# EAGLE design PWR1 (EAGLE 4.16)
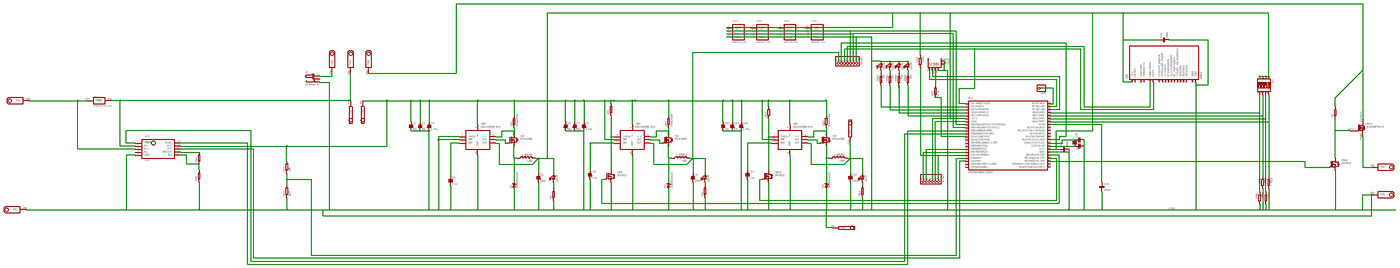
[diagram p0: schematic, sheet 1, overview]
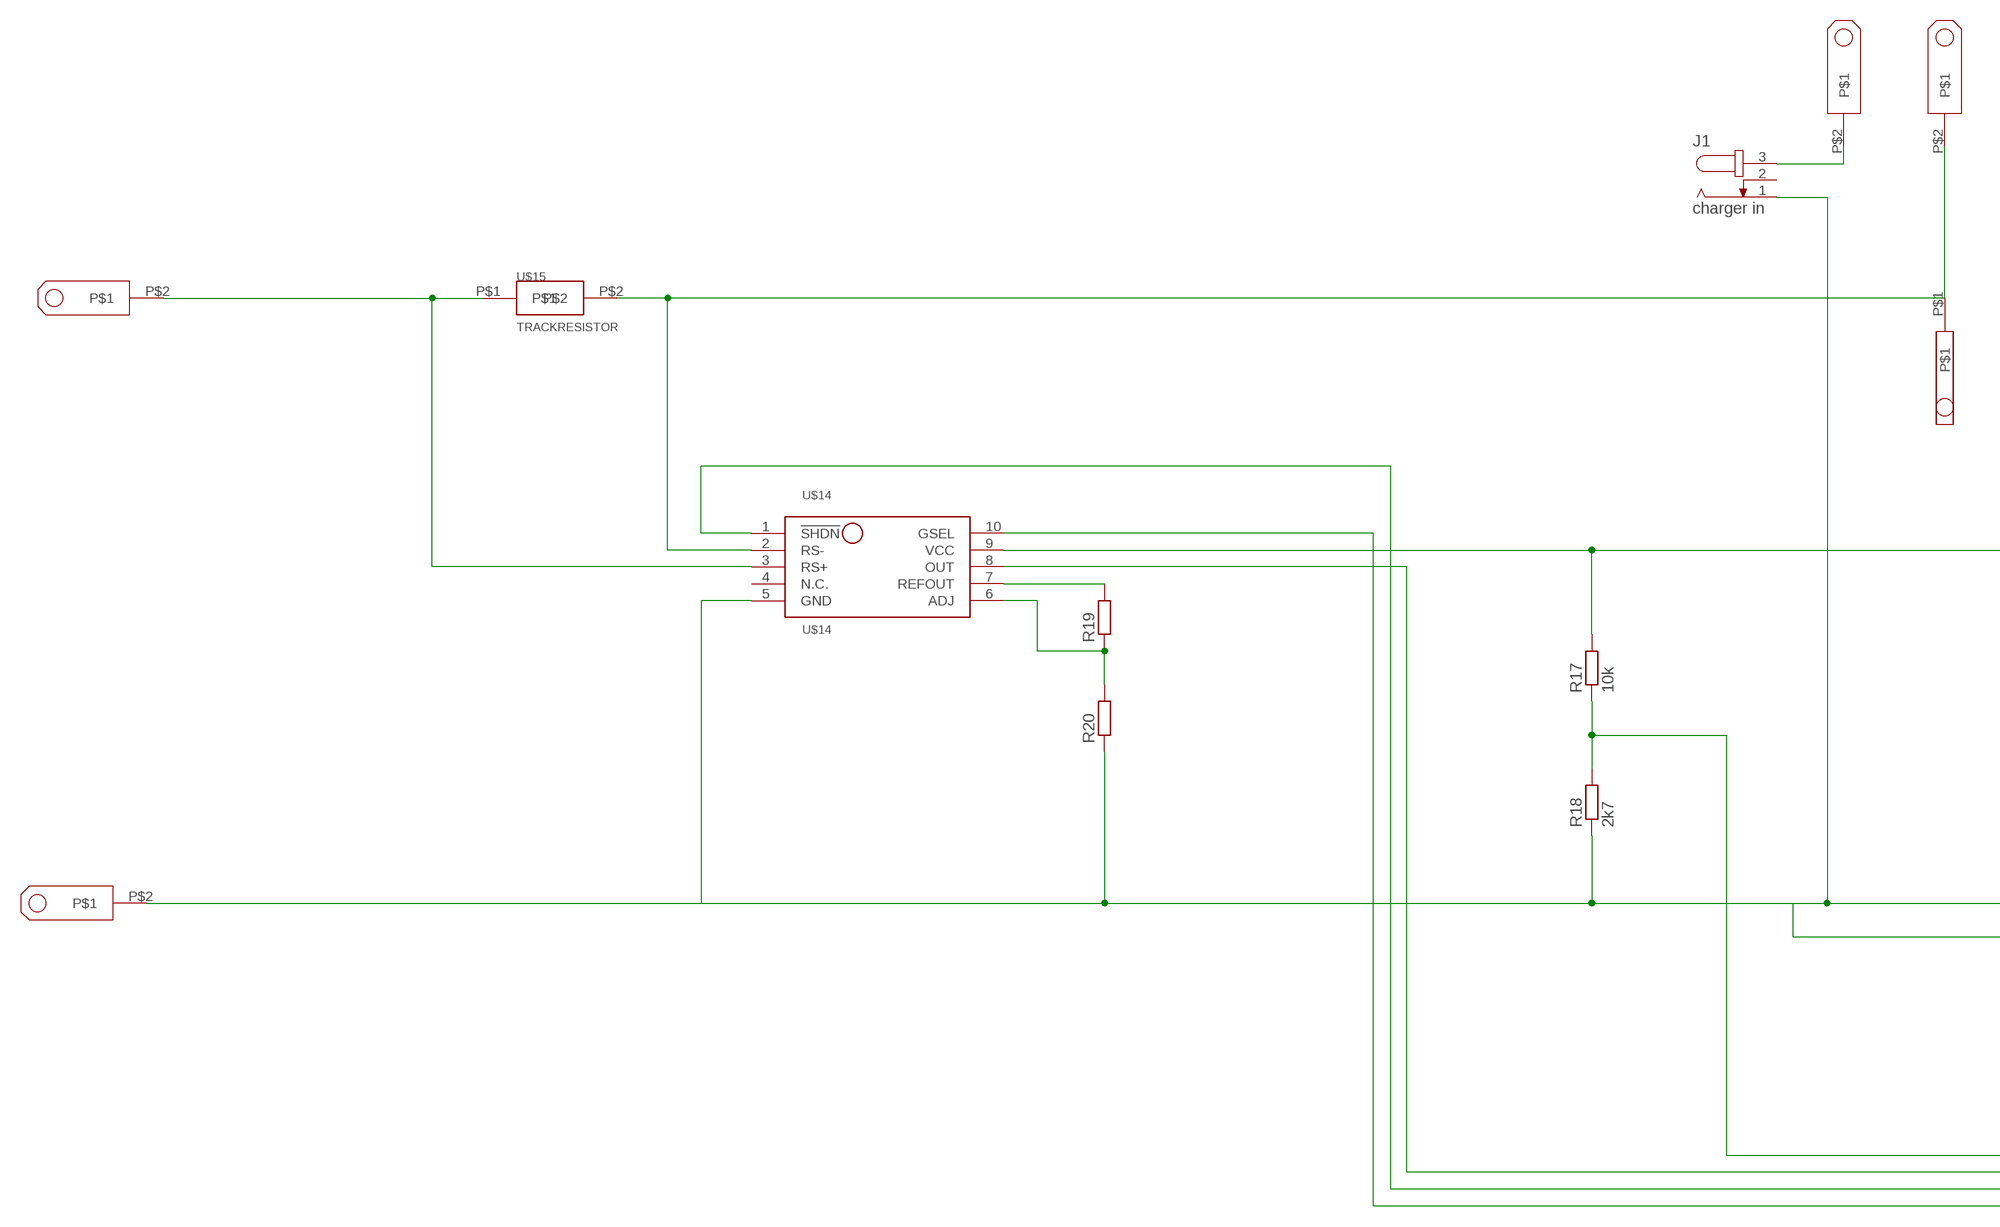
[diagram p1: schematic, sheet 1, part 1 of 4]
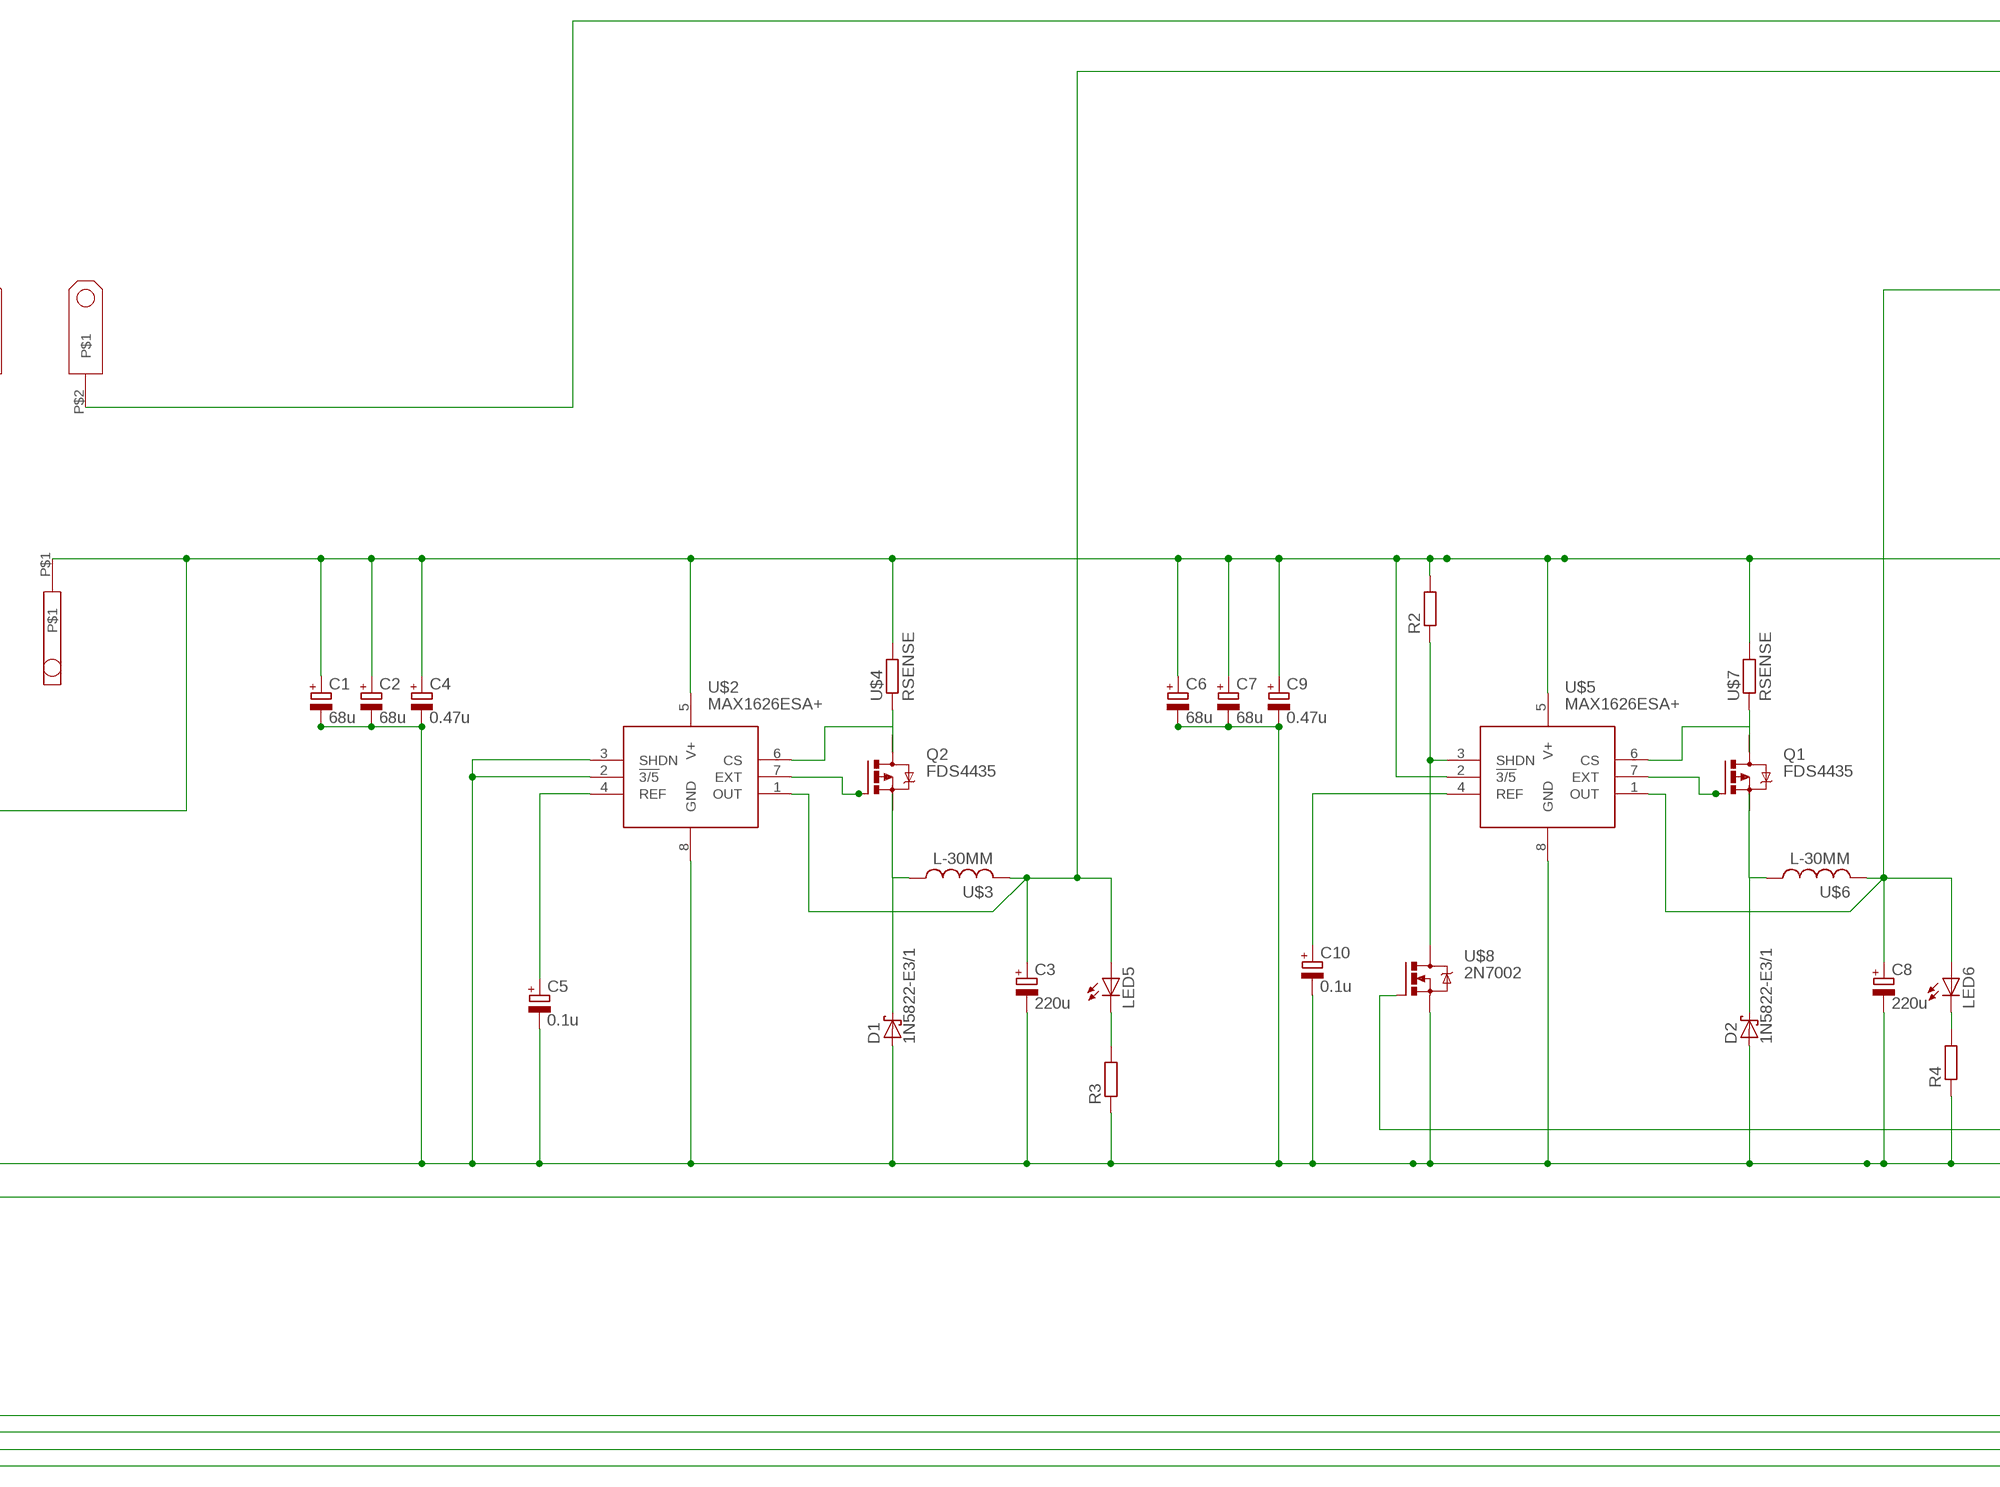
[diagram p2: schematic, sheet 1, part 2 of 4]
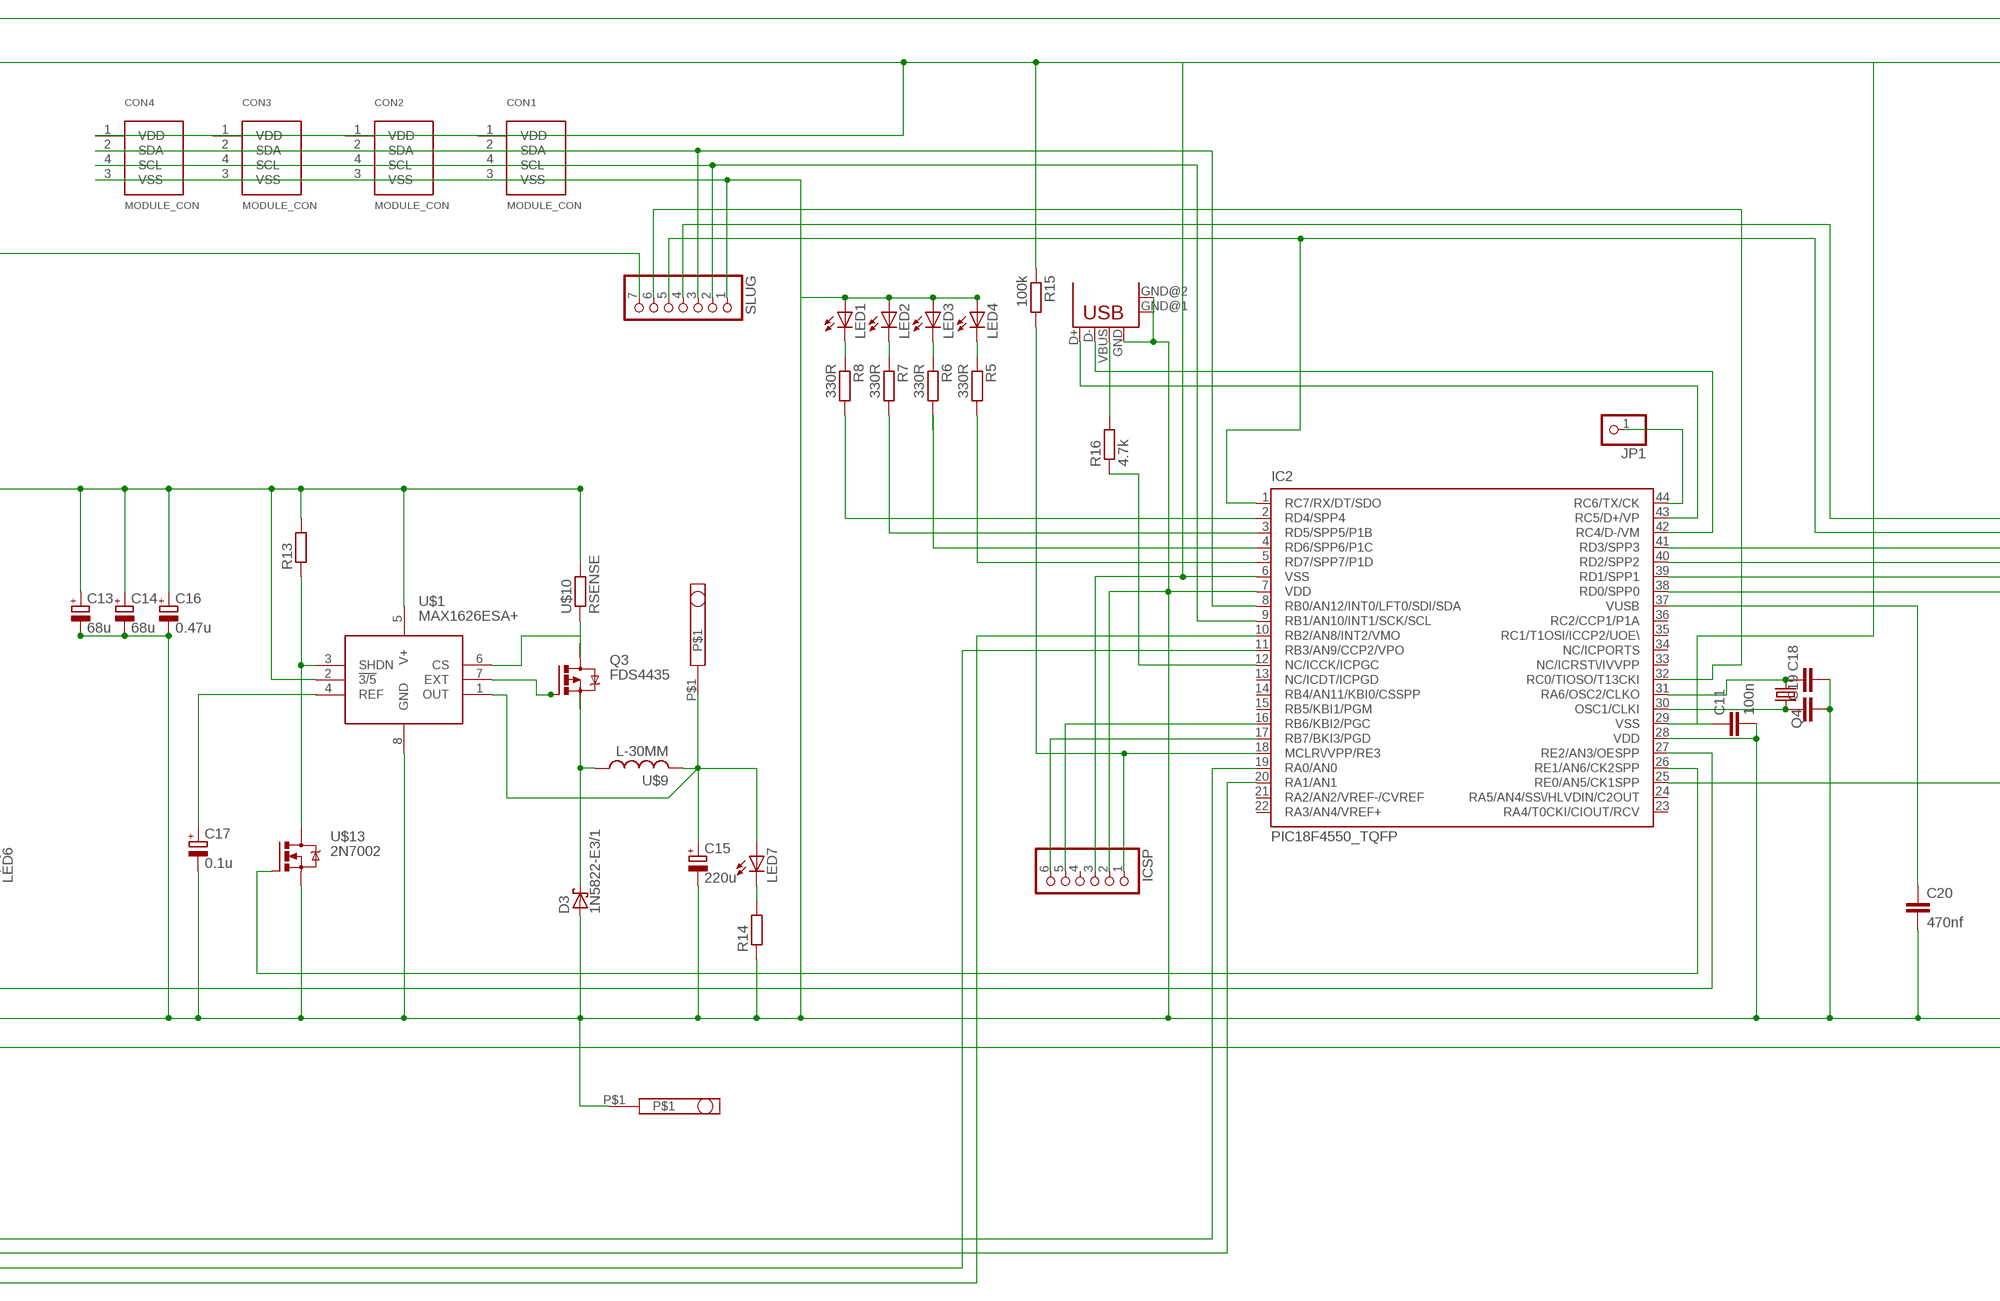
[diagram p3: schematic, sheet 1, part 3 of 4]
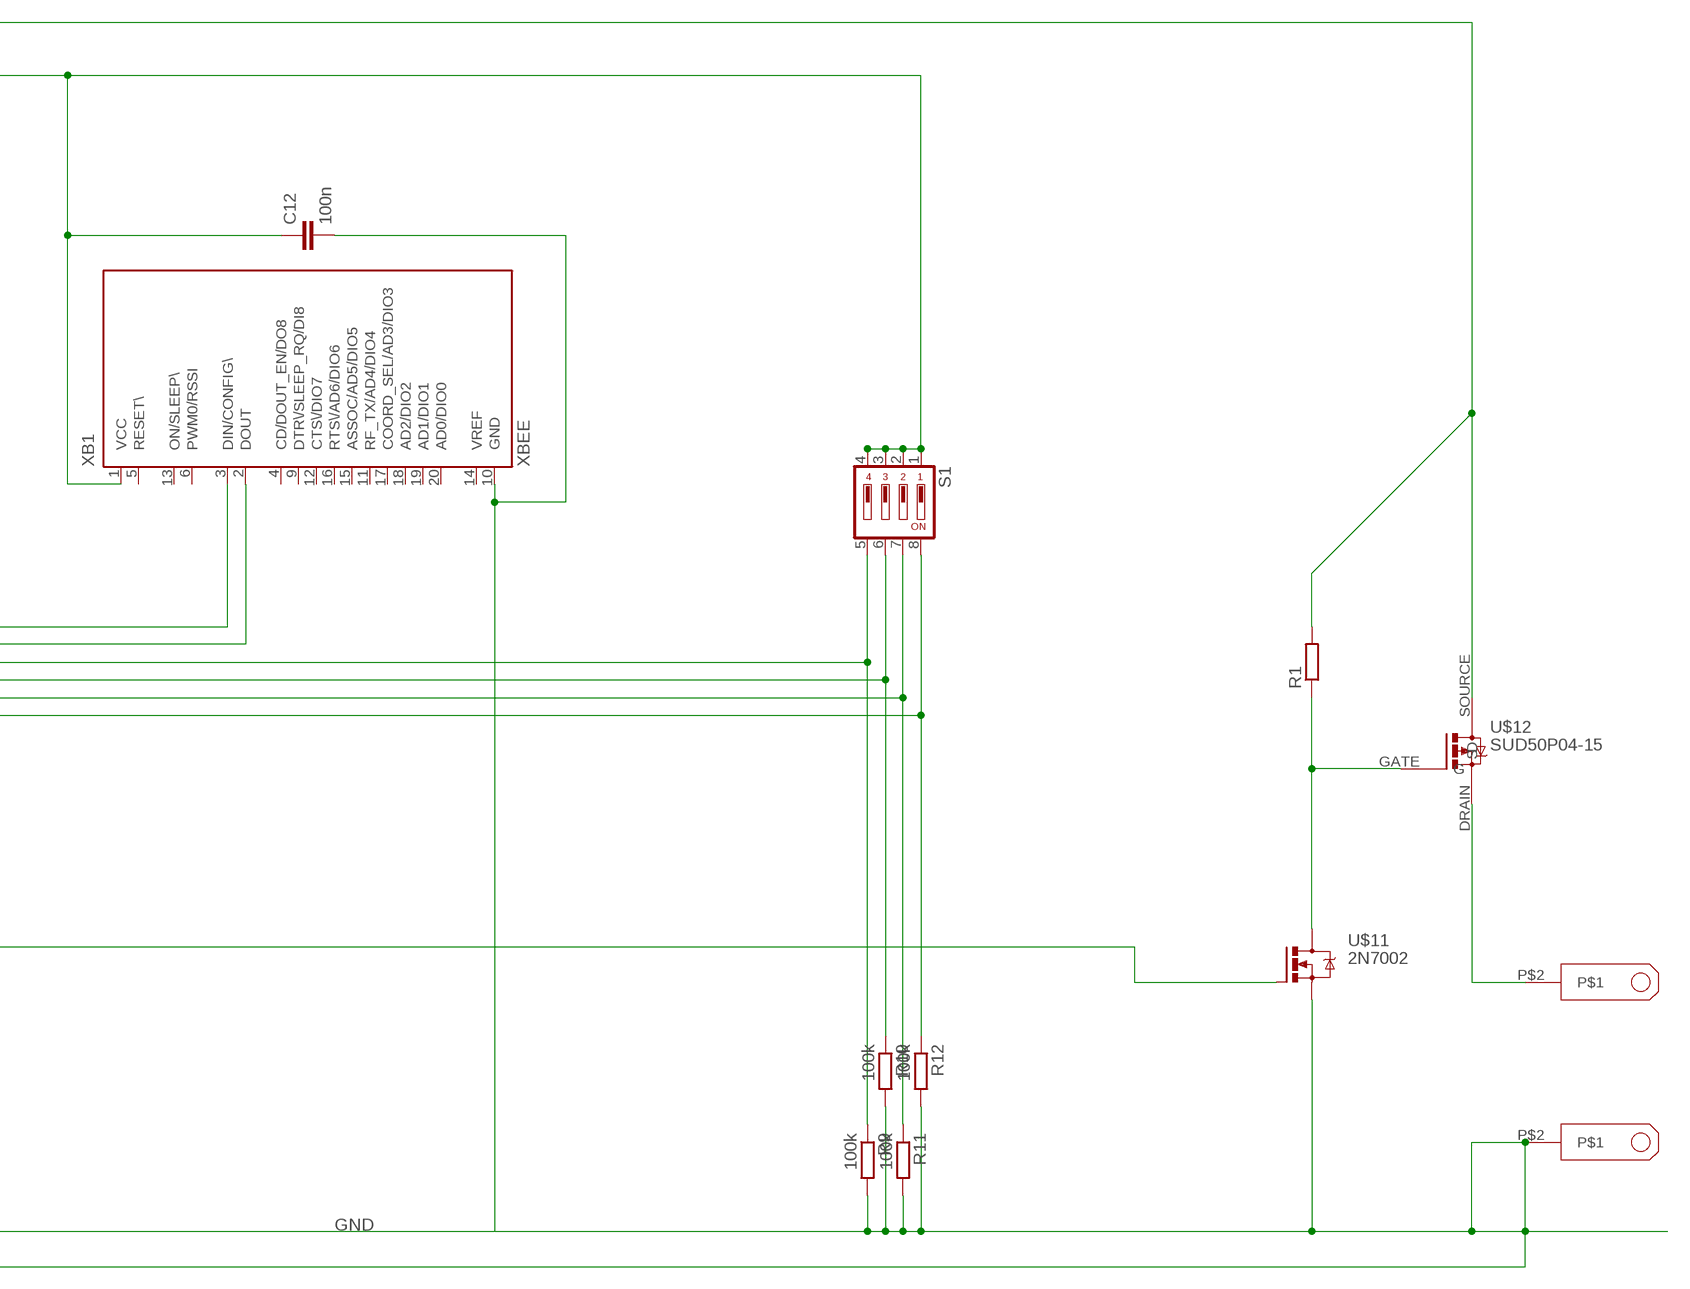
[diagram p4: schematic, sheet 1, part 4 of 4]

## Parts
C1  68u  CPOL-EUE3.5-8  [E3,5-8]
C2  68u  CPOL-EUE3.5-8  [E3,5-8]
C3  220u  CPOL-EUE2.5-6  [E2,5-6]
C4  0.47u  CPOL-EUE2.5-5  [E2,5-5]
C5  0.1u  CPOL-EUE1.8-4  [E1,8-4]
C6  68u  CPOL-EUE3.5-8  [E3,5-8]
C7  68u  CPOL-EUE3.5-8  [E3,5-8]
C8  220u  CPOL-EUE2.5-6  [E2,5-6]
C9  0.47u  CPOL-EUE2.5-5  [E2,5-5]
C10  0.1u  CPOL-EUE1.8-4  [E1,8-4]
C11  100n  C-EUC0603  [C0603]
C12  100n  C-EUC0603  [C0603]
C13  68u  CPOL-EUE3.5-8  [E3,5-8]
C14  68u  CPOL-EUE3.5-8  [E3,5-8]
C15  220u  CPOL-EUE2.5-6  [E2,5-6]
C16  0.47u  CPOL-EUE2.5-5  [E2,5-5]
C17  0.1u  CPOL-EUE1.8-4  [E1,8-4]
C18  C-EUC1206K  [C1206K]
C19  C-EUC1206K  [C1206K]
C20  470nf  C-EUC0603  [C0603]
CHRG-CHARGE  6.3X0.8-SPADE  [SPADE]
CHRG-COM  6.3X0.8-SPADE  [SPADE]
CHRG-RUN  6.3X0.8-SPADE  [SPADE]
CON1  MODULE_CON  [RJ11]
CON2  MODULE_CON  [RJ11]
CON3  MODULE_CON  [RJ11]
CON4  MODULE_CON  [RJ11]
D1  1N5822-E3/1  SCHOTTKY-DIODEDO201T15  [DO201T15]
D2  1N5822-E3/1  SCHOTTKY-DIODEDO201T15  [DO201T15]
D3  1N5822-E3/1  SCHOTTKY-DIODEDO201T15  [DO201T15]
IC2  PIC18F4550_TQFP  [TQFP44]
ICSP  PINHD-1X6  [1X06]
J1  charger in  JACK-PLUG0  [SPC4077]
JP1  PINHD-1X1  [1X01]
LED1  LED3MM  [LED3MM]
LED2  LED3MM  [LED3MM]
LED3  LED3MM  [LED3MM]
LED4  LED3MM  [LED3MM]
LED5  LED3MM  [LED3MM]
LED6  LED3MM  [LED3MM]
LED7  LED3MM  [LED3MM]
LOGICPWR1  4.8X0.8-SPADE  [SPADE]
LOGICPWR2  4.8X0.8-SPADE  [SPADE]
MOTPWR+  6.3X0.8-SPADE  [SPADE]
MOTPWRGND  6.3X0.8-SPADE  [SPADE]
Q1  FDS4435  P-MOSFET-SO8  [SO-08]
Q2  FDS4435  P-MOSFET-SO8  [SO-08]
Q3  FDS4435  P-MOSFET-SO8  [SO-08]
Q4  CRYSTALSM49  [SM49]
R1  R-EU_M1206  [M1206]
R2  R-EU_M1206  [M1206]
R3  R-EU_M1206  [M1206]
R4  R-EU_M1206  [M1206]
R5  330R  R-EU_M1206  [M1206]
R6  330R  R-EU_M1206  [M1206]
R7  330R  R-EU_M1206  [M1206]
R8  330R  R-EU_M1206  [M1206]
R9  100k  R-EU_M1206  [M1206]
R10  100k  R-EU_M1206  [M1206]
R11  100k  R-EU_M1206  [M1206]
R12  100k  R-EU_M1206  [M1206]
R13  R-EU_M1206  [M1206]
R14  R-EU_M1206  [M1206]
R15  100k  R-EU_M1206  [M1206]
R16  4.7k  R-EU_M1206  [M1206]
R17  10k  R-EU_M1206  [M1206]
R18  2k7  R-EU_M1206  [M1206]
R19  R-EU_M1206  [M1206]
R20  R-EU_M1206  [M1206]
S1  DP04  [DP-04]
SERVO+VE  4.8X0.8-SPADE  [SPADE]
SERVO_GND  4.8X0.8-SPADE  [SPADE]
SLUG  PINHD-1X7  [1X07]
U$1  MAX1626ESA+  [SO04]
U$2  MAX1626ESA+  [SO04]
U$3  L-30MM  [30MMRES]
U$4  RSENSE  [PWR-RES]
U$5  MAX1626ESA+  [SO04]
U$6  L-30MM  [30MMRES]
U$7  RSENSE  [PWR-RES]
U$8  2N7002  [SOT23]
U$9  L-30MM  [30MMRES]
U$10  RSENSE  [PWR-RES]
U$11  2N7002  [SOT23]
U$12  SUD50P04-15  [TO252-3]
U$13  2N7002  [SOT23]
U$14  MAX4069  [UMAX]
U$15  TRACKRESISTOR  [TRACK-RESISTOR]
USB1  USB-B-H  [USB-B-H]
VBATT+VE  6.3X0.8-SPADE  [SPADE]
VBATT-VE  6.3X0.8-SPADE  [SPADE]
XB1  XBEE  [XBEE]

## Nets
GND: C1.- C2.- C3.- C4.- C5.- C6.- C7.- C8.- C9.- C10.- C11.2 C12.2 C13.- C14.- C15.- C16.- C17.- C18.2 C19.2 C20.2 CON1.3(VSS) CON2.3(VSS) CON3.3(VSS) CON4.3(VSS) D1.A D2.A D3.A IC2.7(VDD) IC2.28(VDD) ICSP.2 J1.1 LED1.A LED2.A LED3.A LED4.A MOTPWRGND.P$2 R3.1 R4.1 R9.2 R10.2 R11.2 R12.2 R14.1 R18.1 R20.1 SERVO_GND.P$1 SLUG.1 U$1.8(GND) U$2.2(!3/5) U$2.3(SHDN) U$2.8(GND) U$5.8(GND) U$8.2(S) U$11.2(S) U$13.2(S) U$14.5(GND) USB1.GND USB1.GND@1(GND) USB1.GND@2(GND) VBATT-VE.P$2 XB1.10(GND)
N$2: CHRG-COM.P$2 LOGICPWR1.P$1 U$14.2(RS-) U$15.P$2
N$5: Q2.5(D) Q2.6(D) Q2.7(D) Q2.8(D) U$2.6(CS) U$4.P$1
N$6: C5.+ U$2.4(REF)
N$7: D1.C Q2.1(S) Q2.2(S) Q2.3(S) U$3.1
N$8: C17.+ U$1.4(REF)
N$9: IC2.32(RC0/TIOSO/T13CKI) SLUG.6
N$10: Q2.4(G) U$2.7(EXT)
N$11: Q3.5(D) Q3.6(D) Q3.7(D) Q3.8(D) U$1.6(CS) U$10.P$1
N$12: C10.+ U$5.4(REF)
N$13: Q1.5(D) Q1.6(D) Q1.7(D) Q1.8(D) U$5.6(CS) U$7.P$1
N$14: D2.C Q1.1(S) Q1.2(S) Q1.3(S) U$6.1
N$15: Q1.4(G) U$5.7(EXT)
N$17: MOTPWR+.P$2 U$12.DRAIN(D)
N$18: R1.1 U$11.3(D) U$12.GATE(G)
N$19: D3.C Q3.1(S) Q3.2(S) Q3.3(S) U$9.1
N$20: Q3.4(G) U$1.7(EXT)
N$21: LED1.K(C) R8.1
N$22: LED2.K(C) R7.1
N$23: LED3.K(C) R6.1
N$24: LED4.K(C) R5.1
N$25: IC2.41(RD3/SPP3) R9.1 S1.5
N$26: IC2.40(RD2/SPP2) R10.1 S1.6
N$27: IC2.39(RD1/SPP1) R11.1 S1.7
N$28: IC2.38(RD0/SPP0) R12.1 S1.8
N$29: R2.1 U$5.3(SHDN) U$8.3(D)
N$30: LED5.K(C) R3.2
N$31: LED6.K(C) R4.2
N$32: IC2.18(MCLR\/VPP/RE3) ICSP.1 R15.2
N$35: C15.+ LED7.A SERVO+VE.P$1 U$1.1(OUT) U$9.2
N$36: R13.1 U$1.3(SHDN) U$13.3(D)
N$37: LED7.K(C) R14.2
N$38: IC2.26(RE1/AN6/CK2SPP) U$13.1(G)
N$39: U$14.3(RS+) U$15.P$1 VBATT+VE.P$2
N$40: C20.1 IC2.37(VUSB)
N$42: IC2.25(RE0/AN5/CK1SPP) U$11.1(G)
N$43: IC2.27(RE2/AN3/OESPP) U$8.1(G)
N$44: IC2.3(RD5/SPP5/P1B) R7.2
N$46: SLUG.4 XB1.3(DIN/CONFIG\)
N$47: IC2.16(RB6/KBI2/PGC) ICSP.5
N$48: IC2.17(RB7/BKI3/PGD) ICSP.6
N$49: R16.2 USB1.VBUS
N$50: IC2.2(RD4/SPP4) R8.2
N$51: IC2.42(RC4/D-/VM) USB1.D-
N$52: IC2.43(RC5/D+/VP) USB1.D+
N$53: IC2.5(RD7/SPP7/P1D) R5.2
N$54: CHRG-CHARGE.P$2 J1.3
N$55: IC2.44(RC6/TX/CK) JP1.1
N$56: R19.2 U$14.7(REFOUT)
N$57: IC2.19(RA0/AN0) R17.1 R18.2
N$58: R19.1 R20.2 U$14.6(ADJ)
N$59: IC2.1(RC7/RX/DT/SDO) SLUG.5 XB1.2(DOUT)
N$60: IC2.20(RA1/AN1) U$14.8(OUT)
N$61: IC2.11(RB3/AN9/CCP2/VPO) U$14.1(!SHDN)
N$62: IC2.10(RB2/AN8/INT2/VMO) U$14.10(GSEL)
N$63: IC2.12(NC/ICCK/ICPGC) R16.1
N$67: C19.1 IC2.30(OSC1/CLKI) Q4.2
N$68: C18.1 IC2.31(RA6/OSC2/CLKO) Q4.1
N$69: IC2.4(RD6/SPP6/P1C) R6.2
SCL: CON1.4(SCL) CON2.4(SCL) CON3.4(SCL) CON4.4(SCL) IC2.9(RB1/AN10/INT1/SCK/SCL) SLUG.2
SDA: CON1.2(SDA) CON2.2(SDA) CON3.2(SDA) CON4.2(SDA) IC2.8(RB0/AN12/INT0/LFT0/SDI/SDA) SLUG.3
VLOGICRAW: C1.+ C2.+ C4.+ C6.+ C7.+ C9.+ C13.+ C14.+ C16.+ LOGICPWR2.P$1 R2.2 R13.2 R17.2 U$1.2(!3/5) U$1.5(V+) U$2.5(V+) U$4.P$2 U$5.2(!3/5) U$5.5(V+) U$7.P$2 U$10.P$2 U$14.9(VCC)
VRAW: CHRG-RUN.P$2 R1.2 U$12.SOURCE(S)
VREG3.3: C3.+ C11.1 C12.1 CON1.1(VDD) CON2.1(VDD) CON3.1(VDD) CON4.1(VDD) IC2.6(VSS) IC2.29(VSS) ICSP.3 LED5.A R15.1 S1.1 S1.2 S1.3 S1.4 U$2.1(OUT) U$3.2 XB1.1(VCC)
VREGSLUG5: C8.+ LED6.A SLUG.7 U$5.1(OUT) U$6.2
Unconnected: IC2.13(NC/ICDT/ICPGD) IC2.14(RB4/AN11/KBI0/CSSPP) IC2.15(RB5/KBI1/PGM) IC2.21(RA2/AN2/VREF-/CVREF) IC2.22(RA3/AN4/VREF+) IC2.23(RA4/T0CKI/CIOUT/RCV) IC2.24(RA5/AN4/SS\/HLVDIN/C2OUT) IC2.33(NC/ICRST\/IVVPP) IC2.34(NC/ICPORTS) IC2.35(RC1/T1OSI/ICCP2/UOE\) IC2.36(RC2/CCP1/P1A) ICSP.4 J1.2 XB1.4(CD/DOUT_EN/DO8) XB1.5(RESET\) XB1.6(PWM0/RSSI) XB1.9(DTR\/SLEEP_RQ/DI8) XB1.11(RF_TX/AD4/DIO4) XB1.12(CTS\/DIO7) XB1.13(ON/SLEEP\) XB1.14(VREF) XB1.15(ASSOC/AD5/DIO5) XB1.16(RTS\/AD6/DIO6) XB1.17(COORD_SEL/AD3/DIO3) XB1.18(AD2/DIO2) XB1.19(AD1/DIO1) XB1.20(AD0/DIO0)

## Power pins joined to a net without a drawn wire
N.C.: U$14.4(N.C.)

## Library data of the parts
C1-C10 C13-C17 = rcl:CPOL-EU: POLARIZED CAPACITOR, European symbol
C11 C12 C18-C20 = rcl:C-EU: CAPACITOR, European symbol
CHRG-CHARGE CHRG-COM CHRG-RUN MOTPWR+ MOTPWRGND VBATT+VE VBATT-VE = ecssr-Pwr:6.3X0.8-SPADE
CON1-CON4 = ecssr:MODULE_CON
D1-D3 = diode:SCHOTTKY-DIODE: Schottky Diode
IC2 = microchip:PIC18F4*_TQFP: USB Microcontrollers with nanoWatt Technology High-Performance, Enhanced Flash, 28/40/44-Pin, Source: http://ww1.microchip.com/downloads/en/devicedoc/39632c.pdf
ICSP = pinhead:PINHD-1X6: PIN HEADER
J1 = con-jack:JACK-PLUG: DC POWER JACK Power Jack, DC, Right Angle, Through Hole, Rated 5A at 16VDC, PC Terminals Distributor: Farnell (www.Farnell.de) Drawing: 84N1161.pdf / 84N1162.pdf Manufacturer: SPC Technology (www.spctechnology.com) Type: SPC4077 / SPC 4078
JP1 = pinhead:PINHD-1X1: PIN HEADER
LED1-LED7 = led:LED: LED OSRAM: - CHIPLED LG R971, LG N971, LY N971, LG Q971, LY Q971, LO R971, LY R971 LH N974, LH R974 LS Q976, LO Q976, LY Q976 LO Q996 - Hyper CHIPLED LW Q18S LB Q993, LB Q99A, LB R99A - SideLED LS A670, LO A670, LY A670, LG A670, LP A670 LB A673, LV A673, LT A673, LW A673 LH A674 LY A675 LS A676, LA A676, LO A676, LY A676, LW A676 LS A679, LY A679, LG A679 - Hyper Micro SIDELED® LS Y876, LA Y876, LO Y876, LY Y876 LT Y87S - SmartLED LW L88C, LW L88S LB L89C, LB L89S, LG L890 LS L89K, LO L89K, LY L89K LS L896, LA L896, LO L896, LY L896 - TOPLED LS T670, LO T670, LY T670, LG T670, LP T670 LSG T670, LSP T670, LSY T670, LOP T670, LYG T670 LG T671, LOG T671, LSG T671 LB T673, LV T673, LT T673, LW T673 LH T674 LS T676, LA T676, LO T676, LY T676, LB T676, LH T676, LSB T676, LW T676 LB T67C, LV T67C, LT T67C, LS T67K, LO T67K, LY T67K, LW E67C LS E67B, LA E67B, LO E67B, LY E67B, LB E67C, LV E67C, LT E67C LW T67C LS T679, LY T679, LG T679 LS T770, LO T770, LY T770, LG T770, LP T770 LB T773, LV T773, LT T773, LW T773 LH T774 LS E675, LA E675, LY E675, LS T675 LS T776, LA T776, LO T776, LY T776, LB T776 LHGB T686 LT T68C, LB T68C - Hyper Mini TOPLED® LB M676 - Mini TOPLED Santana® LG M470 LS M47K, LO M47K, LY M47K Source: http://www.osram.convergy.de - LUMILED® LXK2-PW12-R00, LXK2-PW12-S00, LXK2-PW14-U00, LXK2-PW14-V00 LXK2-PM12-R00, LXK2-PM12-S00, LXK2-PM14-U00 LXK2-PE12-Q00, LXK2-PE12-R00, LXK2-PE12-S00, LXK2-PE14-T00, LXK2-PE14-U00 LXK2-PB12-K00, LXK2-PB12-L00, LXK2-PB12-M00, LXK2-PB14-N00, LXK2-PB14-P00, LXK2-PB14-Q00 LXK2-PR12-L00, LXK2-PR12-M00, LXK2-PR14-Q00, LXK2-PR14-R00 LXK2-PD12-Q00, LXK2-PD12-R00, LXK2-PD12-S00 LXK2-PH12-R00, LXK2-PH12-S00 LXK2-PL12-P00, LXK2-PL12-Q00, LXK2-PL12-R00 Source: www.luxeon.com
LOGICPWR1 LOGICPWR2 SERVO+VE SERVO_GND = ecssr-Pwr:4.8X0.8-SPADE
Q1-Q3 = transistor-power:P-MOSFET-SO8: P-Channel MOSFET Example: FDS4435A; P-Channel Logic Level PowerTrench® MOSFET FDS4465; P-Channel 1.8V Specified PowerTrench® MOSFET Source: www.fairchildsemi.com
Q4 = crystal:CRYSTAL: CRYSTAL
R1-R20 = rcl:R-EU_: RESISTOR, European symbol
S1 = switch-dil:DP04: DIL/CODE SWITCH
SLUG = pinhead:PINHD-1X7: PIN HEADER
U$1 U$2 U$5 = ecssr-Pwr:MAX1626ESA+
U$3 U$6 U$9 = ecssr-Pwr:L-30MM
U$4 U$7 U$10 = ecssr-Pwr:RSENSE
U$8 U$11 U$13 = ecssr:2N7002
U$12 = ecssr-Pwr:SUD50P04-15
U$14 = ecssr-Pwr:MAX4069
U$15 = ecssr-Pwr:TRACKRESISTOR
USB1 = con-usb-2:USB: USB Connectors
XB1 = maxstream:XBEE: XBee (TM) /XBee-PRO(TM) OEM RF Modules Source: MaxStream, Inc. xbee_productmanual.pdf

## Board
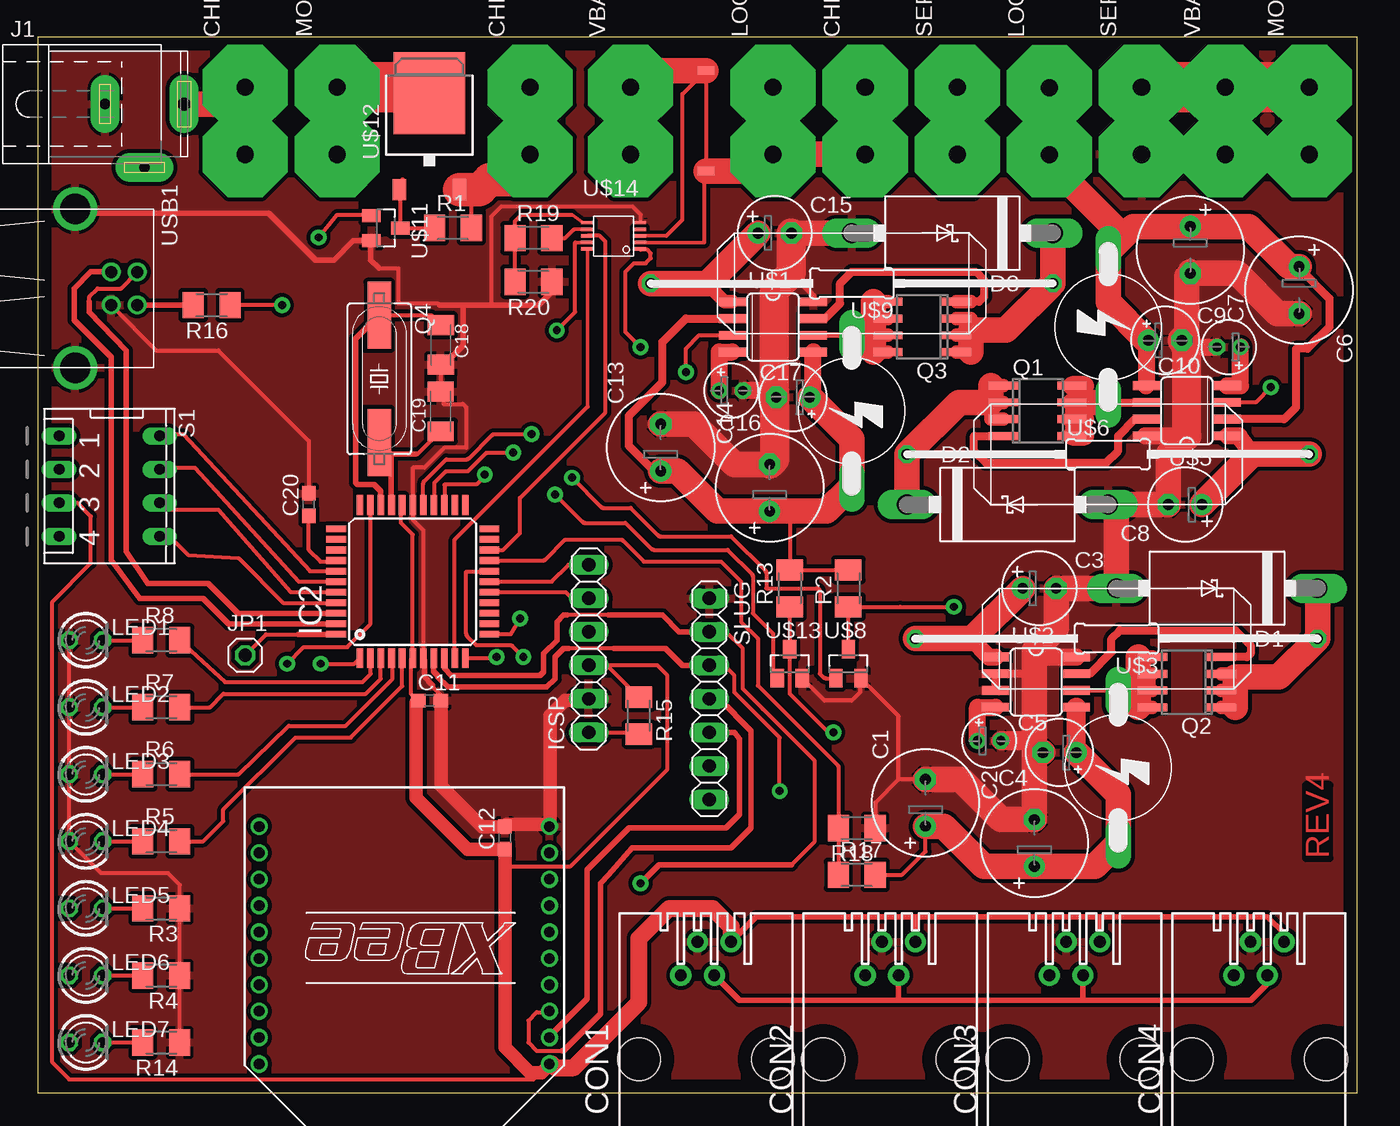
[diagram p5: board, top side]
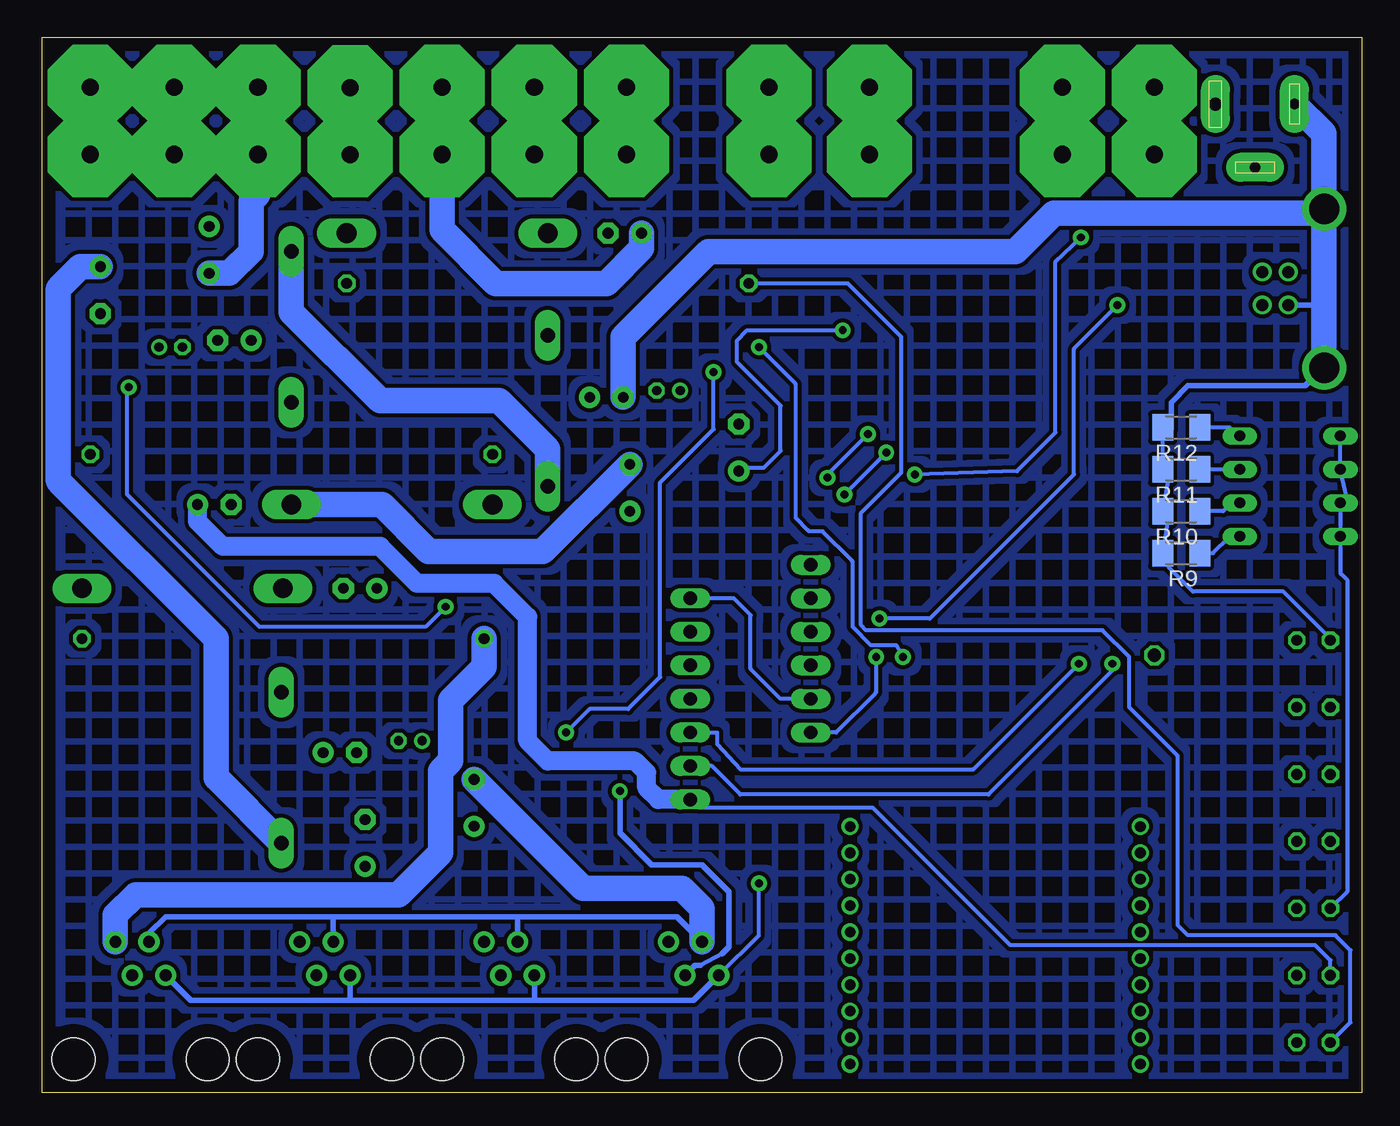
[diagram p6: board, bottom side, seen from below]

Size 100 x 80 mm. Coordinates in mm from the lower left corner, seen from the top.
Outline: 0,0 100,0 100,80 0,80 0,0
Copper layers (1*16): Top 0.035mm / dielectric 1.5mm / Bottom 0.035mm
Design rules "default": minimum track width 0.2mm, minimum drill 0.6mm, track to track 0.1mm, track to pad 0.1mm, pad to pad 0.1mm, via to via 0.1mm, smd to smd 0mil, copper to edge 40mil, drill to drill 8mil, minimum pad ring 10mil, minimum via ring 8mil, stop-mask expansion 4mil, vias tented up to drill 0mil, thermal gap 10mil

### Footprints (pad centres in the part's own frame; a part is rotated, then mirrored left to right if it is on the bottom)
E3,5-8 = drill 0.813 pad 1.6 round: + -1.778,0 | drill 0.813 pad 1.6 octagon: - 1.778,0
E2,5-6 = drill 0.813 pad 1.6 round: + -1.27,0 | drill 0.813 pad 1.6 octagon: - 1.27,0
E2,5-5 = drill 0.813 pad 1.6 round: + -1.27,0 | drill 0.813 pad 1.6 octagon: - 1.27,0
E1,8-4 = drill 0.711 pad 1.168 round: + -0.889,0 | drill 0.711 pad 1.168 octagon: - 0.889,0
C0603 = smd 1.1 x 1: 1 -0.85,0; 2 0.85,0
C1206K = smd 1.5 x 2: 1 -1.5,0; 2 1.5,0
SPADE = drill 1.3 pad 6.452 octagon: P$1 -5.08,-3.175; P$2 0,-3.175
RJ11 = drill 0.889 pad 1.6 round: 1 1.905,7.62; 2 0.635,5.08; 3 -0.635,7.62; 4 -1.905,5.08 | hole 3.251: -5.08,-1.27; 5.08,-1.27
DO201T15 = drill 1.499 long: A 7.62,0; C -7.62,0
TQFP44 = smd 1.5 x 0.5: 1 -5.8,4; 2 -5.8,3.2; 3 -5.8,2.4; 4 -5.8,1.6; 5 -5.8,0.8; 6 -5.8,0; 7 -5.8,-0.8; 8 -5.8,-1.6; 9 -5.8,-2.4; 10 -5.8,-3.2; 11 -5.8,-4; 23 5.8,-4; 24 5.8,-3.2; 25 5.8,-2.4; 26 5.8,-1.6; 27 5.8,-0.8; 28 5.8,0; 29 5.8,0.8; 30 5.8,1.6; 31 5.8,2.4; 32 5.8,3.2; 33 5.8,4 | smd 0.5 x 1.5: 12 -4,-5.8; 13 -3.2,-5.8; 14 -2.4,-5.8; 15 -1.6,-5.8; 16 -0.8,-5.8; 17 0,-5.8; 18 0.8,-5.8; 19 1.6,-5.8; 20 2.4,-5.8; 21 3.2,-5.8; 22 4,-5.8; 34 4,5.8; 35 3.2,5.8; 36 2.4,5.8; 37 1.6,5.8; 38 0.8,5.8; 39 0,5.8; 40 -0.8,5.8; 41 -1.6,5.8; 42 -2.4,5.8; 43 -3.2,5.8; 44 -4,5.8
1X06 = drill 1.016 long: 1 -6.35,0; 2 -3.81,0; 3 -1.27,0; 4 1.27,0; 5 3.81,0; 6 6.35,0
SPC4077 = drill 0.8 pad 2.184 long: 1 -3,0; 2 0,-4.8 | drill 1 pad 2.184 long: 3 3,0
1X01 = drill 1.016 octagon: 1 0,0
LED3MM = drill 0.813 octagon: A -1.27,0; K 1.27,0
SO-08 = smd 0.6 x 2.2: 1 -1.905,-2.6; 2 -0.635,-2.6; 3 0.635,-2.6; 4 1.905,-2.6; 5 1.905,2.6; 6 0.635,2.6; 7 -0.635,2.6; 8 -1.905,2.6
SM49 = smd 5.08 x 1.778: 1 -4.826,0; 2 4.826,0
M1206 = smd 1.6 x 2: 1 -1.4,0; 2 1.4,0
DP-04 = drill 0.813 long: 1 -3.81,-3.81; 2 -1.27,-3.81; 3 1.27,-3.81; 4 3.81,-3.81; 5 3.81,3.81; 6 1.27,3.81; 7 -1.27,3.81; 8 -3.81,3.81
1X07 = drill 1.016 long: 1 -7.62,0; 2 -5.08,0; 3 -2.54,0; 4 0,0; 5 2.54,0; 6 5.08,0; 7 7.62,0
SO04 = smd 0.66 x 2.032: 1 -4.445,-0.533; 2 -3.175,-0.533; 3 -1.905,-0.533; 4 -0.635,-0.533; 5 -0.635,5.613; 6 -1.905,5.613; 7 -3.175,5.613; 8 -4.445,5.613
30MMRES = drill 0.813 octagon: 1 -15.24,0; 2 15.24,0
PWR-RES = drill 1.1 pad 1.93 long: P$1 -5.715,0; P$2 5.715,0
SOT23 = smd 1 x 1.4: 1 -0.95,-1.1; 2 0.95,-1.1; 3 0,1.1
TO252-3 = smd 5.4 x 6.2: DRAIN 0.12,1.58 | smd 1 x 1.6: GATE -2.16,-5.72; SOURCE 2.4,-5.72
UMAX = smd 0.94 x 0.254: 1 -1.358,0.193; 2 -1.358,-0.307; 3 -1.358,-0.808; 4 -1.358,-1.308; 5 -1.358,-1.808; 6 2.616,-1.808; 7 2.616,-1.308; 8 2.616,-0.808; 9 2.616,-0.307; 10 2.616,0.193
TRACK-RESISTOR = smd 0.635 x 1.27: P$1 -3.81,0; P$2 3.81,0
USB-B-H = drill 0.914 round: D+ 0,1.25; D- 1.981,1.25; GND 0,-1.25; VBUS 1.981,-1.25 | drill 2.286 round: GND@1 -2.718,6.02; GND@2 -2.718,-6.02
XBEE = drill 0.8 pad 1.27 round: 1 -11,9; 2 -11,7; 3 -11,5; 4 -11,3; 5 -11,1; 6 -11,-1; 7 -11,-3; 8 -11,-5; 9 -11,-7; 10 -11,-9; 11 11,-9; 12 11,-7; 13 11,-5; 14 11,-3; 15 11,-1; 16 11,1; 17 11,3; 18 11,5; 19 11,7; 20 11,9

### Placement (x,y rotation side)
C1  67.27,21.97 90 top
C2  75.53,18.92 90 top
C3  75.91,38.22 0 top
C4  77.43,25.78 180 top
C5  72.1,26.66 0 top
C6  95.59,60.83 270 top
C7  87.34,63.88 270 top
C8  86.96,44.57 180 top
C9  85.43,57.02 0 top
C10  90.26,56.51 180 top
C11  29.68,29.71 0 top
C12  35.39,19.3 90 top
C13  47.21,48.89 90 top
C14  55.46,45.84 90 top
C15  55.84,65.15 0 top
C16  57.24,52.7 180 top
C17  52.54,53.21 0 top
C18  30.54,56.68 270 top
C19  30.52,51.63 90 top
C20  20.54,44.57 90 top
CHRG-CHARGE  12.54,76.19 90 top
CHRG-COM  59.52,76.19 90 top
CHRG-RUN  34.12,76.19 90 top
CON1  50.63,3.8 0 top
CON2  64.61,3.8 0 top
CON3  78.58,3.8 0 top
CON4  92.55,3.8 0 top
D1  89.37,38.22 180 top
D2  73.5,44.57 0 top
D3  69.3,65.15 180 top
IC2  28.41,38.73 90 top
ICSP  41.74,33.65 90 top
J1  8.09,74.92 0 top
JP1  15.71,33.14 0 top
LED1  3.64,34.29 0 top
LED2  3.64,29.2 0 top
LED3  3.64,24.12 0 top
LED4  3.64,19.04 0 top
LED5  3.64,13.97 0 top
LED6  3.64,8.89 0 top
LED7  3.64,3.8 0 top
LOGICPWR1  52.54,76.19 90 top
LOGICPWR2  73.5,76.17 90 top
MOTPWR+  19.52,76.19 90 top
MOTPWRGND  93.18,76.19 90 top
Q1  75.78,51.68 270 top
Q2  87.08,31.11 90 top
Q3  67.02,58.03 90 top
Q4  25.87,54.1 270 top
R1  31.46,65.53 0 top
R2  61.43,38.22 90 top
R3  9.36,13.97 180 top
R4  9.36,8.89 180 top
R5  9.36,19.04 0 top
R6  9.36,24.12 0 top
R7  9.36,29.2 0 top
R8  9.36,34.29 0 top
R9  13.68,40.89 180 bottom
R10  13.68,44.06 180 bottom
R11  13.68,47.24 180 bottom
R12  13.68,50.41 180 bottom
R13  56.98,38.22 90 top
R14  9.36,3.8 180 top
R15  45.55,28.57 270 top
R16  13.17,59.69 180 top
R17  62.06,16.5 0 top
R18  62.06,20.06 180 top
R19  37.55,64.77 0 top
R20  37.55,61.46 180 top
S1  5.42,45.97 270 top
SERVO+VE  66.51,76.19 90 top
SERVO_GND  80.48,76.19 90 top
SLUG  50.89,29.84 270 top
U$1  53.17,55.49 270 top
U$2  73.11,28.57 270 top
U$3  81.75,34.41 180 top
U$4  81.88,24.63 270 top
U$5  89.62,54.22 90 top
U$6  81.11,48.38 0 top
U$7  81.11,58.03 90 top
U$8  61.43,32.51 0 top
U$9  61.68,61.34 180 top
U$10  61.68,51.68 270 top
U$11  26.38,65.53 270 top
U$12  29.55,74.16 0 top
U$13  56.98,32.51 0 top
U$14  44.27,64.13 180 top
U$15  50.63,73.66 270 top
USB1  5.55,60.96 0 top
VBATT+VE  41.74,76.19 90 top
VBATT-VE  86.83,76.19 90 top
XB1  27.77,11.17 180 top

### Tracks (layer width: path | path; a pad name or v marks a point on that pad's centre or on a via)
GND
  Top 0.25: U$14.5 45.68,65.94 45.68,66.54
  Top 0.305: 28.41,44.7 28.41,47.37 29.3,47.37 30.82,48.89 32.47,48.89 32.47,51.94 32.22,52.19 30.73,52.19 30.73,52.91 C19.2 | LED1.A LED2.A LED3.A LED4.A 4.79,16.63 9.87,16.63 10.76,15.74 R3.1 R4.1 | R4.1 | R14.1 R4.1 | C11.2 30.53,30.05 30.57,30.09 29.89,30.77 29.89,30.89 | IC2.7 29.21,42.63 28.41,43.43 28.41,44.7 | 28.41,44.7 IC2.28 | C20.2 20.54,49.4 13.68,56.26 8.98,56.26 5.55,59.69 USB1.GND | R18.1 63.46,21.97 65.24,23.74 | C1.- 67.27,23.87 67.14,23.74 65.24,23.74 | 45.68,66.54 45.05,67.18 35.14,67.18 34.38,66.42 34.38,59.69 | U$13.2 59.63,29.71 61.68,29.71 62.32,30.35 62.32,31.36 62.34,31.36 U$8.2 65.24,28.55 65.24,23.74 | 41.62,29.71 ICSP.2 | 31.5,55.91 31.3,55.91 30.57,55.18 C18.2 30.54,55.21 30.52,55.23 C19.2 | C19.2 30.47,53.18 | 25.87,62.48 27.32,62.48 27.32,59.83 30.32,59.83 30.44,59.71 30.44,59.69
  Top 0.406: 29.89,30.89 29.3,31.49 29.3,32.76 29.17,32.89 IC2.7 | U$1.8 58.79,60.42 57.11,62.1 | 31.5,55.91 32.22,56.64 32.22,59.69 | 30.44,59.69 32.22,59.69 | 25.87,62.48 25.23,63.11 25.23,64.51 25.3,64.58 | 25.3,64.58 25.36,64.64 | 25.3,64.58 U$11.2 23.9,64.58 22.44,63.11 21.04,63.11 17.49,66.67 3.26,66.67 2.88,67.05 2.83,67 USB1.GND@1 | R20.1 38.95,60.7 37.94,59.69 34.38,59.69 32.22,59.69 | 38.7,20.31 38.77,20.24 XB1.10
  Top 0.61: U$2.3 72.58,30.5 72.48,30.6 72.58,30.7 U$2.2 75.53,31.74
  Top 1.016: C11.2 30.57,29.71 30.57,23.24 33.66,20.15 C12.2 35.39,20.19 35.52,20.31 38.7,20.31 | 41.62,29.71 39.97,29.71 38.82,28.57 38.82,20.19 38.81,20.17 XB1.10
  Top 1.27: 87.08,56.51 C10.- | 83.91,49.78 U$5.8 87.08,49.78 | 55.84,52.95 55.71,52.95 C16.- | 55.84,53.21 C17.- | 75.53,33.02 U$2.8
  Top 1.422: 75.53,26.66 C5.-
  Top 1.93: 87.08,49.78 85.69,48.38 C8.- 81.75,44.57 | D2.A 81.75,44.57 | C6.- 93.94,59.05 90.89,62.1 87.47,62.1 87.34,62.23 C7.- 87.08,61.84 87.08,56.64 | C15.- D3.A | C13.- 49.75,50.67 52.79,47.62 C14.- | 75.53,25.78 C2.- 72.99,20.7 69.94,23.74 C1.- | 75.53,25.78 75.53,26.66 75.53,31.74 75.53,33.02 75.53,33.52 77.18,35.17 C3.- D1.A 81.75,44.57 | 75.53,25.78 C4.-
  Top 2.184: C9.- 87.08,56.64 87.08,56.51 87.08,49.78 | C15.- 57.11,62.1 55.84,60.83 55.84,53.21 55.84,52.95 55.84,48 C14.-
  Top 3.81: MOTPWRGND.P$2 VBATT-VE.P$2 83.66,76.19 SERVO_GND.P$1
  Bottom 0.305: 14.57,50.29 14.57,50.28 R12.2 R11.2 14.57,46.98 14.44,46.86 14.57,46.73 R10.2 14.57,43.81 R9.2 14.57,39.75 12.79,37.97 5.93,37.97 2.38,34.41 LED1.A | SLUG.1 47.59,37.46 46.32,36.19 46.32,32.13 44.03,29.84 ICSP.2
  Bottom 0.406: CON4.3 91.91,12.06 90.64,13.33 77.94,13.33 | 63.97,13.33 51.91,13.33 CON1.3 | 63.97,13.33 77.94,13.33 | 63.97,13.33 CON2.3 | 77.94,13.33 CON3.3 | 2.88,54.99 4.28,53.59 13.17,53.59 14.44,52.32 14.44,50.29 R12.2 | USB1.GND 5.53,59.69 2.88,59.69
  Bottom 1.93: J1.1 2.88,72.72 2.88,66.92 | USB1.GND@2 2.88,54.99 2.88,59.69 2.88,66.67 | 2.88,66.92 USB1.GND@1 2.83,66.72 2.88,66.67 | 2.88,66.67 2.88,66.92 | SERVO_GND.P$1 83.66,68.07 84.16,67.56 84.16,63.75 85.81,62.1 C7.- | C14.- 62.06,41.02 70.7,41.02 74.26,44.57 D2.A | 2.88,66.67 23.33,66.67 26.25,63.75 49.49,63.75 55.97,57.27 C16.- | C1.- 59.02,15.49 51.52,15.49 50,13.97 CON1.3
  pour Top (isolate 0.3): -0.69,80.72 -0.74,-0.73 100.77,-0.78 100.7,80.72
N$2
  Top 0.25: U$14.2 50.51,64.44
  Top 0.305: U$15.P$2 50.51,69.84 50.51,64.44
  Top 1.93: U$15.P$2 54.57,69.84 55.84,71.11 LOGICPWR1.P$1 62.7,71.11 CHRG-COM.P$2
N$3
  pour Bottom (isolate 0.3, hatched): -0.34,80.07 -0.14,-0.31 100.17,-0.16 99.92,80.22
N$5
  Top 0.305: U$4.P$1 81.88,30.47 U$2.6
  Top 0.61: Q2.7 84.42,30.47 84.42,31.74
  Top 1.016: 83.4,33.02 Q2.5 | 83.4,31.74 84.42,31.74 Q2.6 | 83.4,30.47 Q2.7 | 83.4,29.2 Q2.8
  Top 1.93: 83.4,30.35 83.4,29.2 | 83.4,30.35 83.4,30.47 83.4,33.02 | U$4.P$1 83.4,30.35
N$6
  Top 1.27: 72.61,29.2 U$2.4 71.21,29.2 C5.+
N$7
  Top 0.61: 90.77,30.47 90.77,31.74
  Top 1.016: 90.77,31.74 Q2.3 | Q2.2 90.77,30.47 | 90.77,29.2 Q2.1
  Top 1.93: 90.77,29.2 90.77,30.47 90.77,31.49 94.07,31.49 U$3.1 D1.C
N$8
  Top 1.27: U$1.4 51.65,56.13 C17.+
N$9  (via drill 0.6 pad 1.2)
  Top 0.305: IC2.32 25.21,35.53 23.46,33.78 20.15,33.78 v18.88,32.51
  Bottom 0.305: v18.88,32.51 18.88,32 28.28,22.6 47.08,22.6 49.24,24.76 SLUG.6
N$10
  Top 0.61: U$2.7 79.72,31.74 81.37,33.4 81.37,34.41 82,35.05 90.77,35.05 91.91,33.9 91.91,33.27 91.66,33.02 Q2.4
N$11
  Top 0.406: U$1.6 U$10.P$1
  Top 1.016: 63.34,59.94 Q3.5 | 63.34,58.67 Q3.6 | 63.34,57.4 Q3.7 | 63.34,56.13 Q3.8
  Top 1.93: 63.34,57.4 63.34,56.13 | 63.34,57.4 63.34,58.67 63.34,59.94 | U$10.P$1 63.34,57.4
N$12
  Top 1.27: 90.13,53.59 U$5.4 91.15,53.59 C10.+
N$13
  Top 0.61: U$7.P$1 U$5.6
  Top 1.016: Q1.5 78.38,50.86 78.32,50.92 Q1.6 78.38,52.13 78.32,52.19 Q1.7 | 79.34,53.59 79.34,52.45 79.46,52.32
  Top 1.422: 79.34,53.59 Q1.8 | Q1.7 79.34,52.32 | Q1.6 79.34,51.05 | Q1.5 79.34,49.78
  Top 1.93: U$7.P$1 79.46,52.32 79.34,52.32
N$14
  Top 1.016: 72.22,53.59 Q1.1 | Q1.2 72.22,52.32 72.22,51.05 Q1.3
  Top 1.93: D2.C U$6.1 69.81,52.32 72.22,52.32 72.22,53.59
N$15
  Top 0.61: U$5.7 83.15,51.05 81.88,49.78 81.88,48.64 80.99,47.75 71.84,47.75 70.95,48.64 70.95,49.78 Q1.4
N$17
  Top 2.54: 29.68,76.5 29.68,76.83
  Top 3.81: U$12.DRAIN 29.68,76.5 29.68,76.19 MOTPWR+.P$2
N$18
  Top 0.305: R1.1 27.65,65.53 27.52,65.4 27.48,65.44 U$11.3 27.48,69.04 27.64,69.2 | 27.64,69.2 27.65,69.21 | 27.64,69.2 U$12.GATE
N$19
  Top 0.406: 70.7,58.67 70.7,57.78 70.7,57.4
  Top 1.016: Q3.1 70.7,56.13 | 70.7,57.4 Q3.2 | 70.7,58.67 Q3.3
  Top 1.93: D3.C U$9.1 76.8,61.34 76.8,61.21 73.37,57.78 70.7,57.78 | 70.7,56.13 70.7,57.4
N$20
  Top 0.61: U$1.7 59.65,58.67 60.8,59.81 60.8,61.34 61.68,62.23 71.08,62.23 71.72,61.59 71.72,60.32 71.34,59.94 70.7,59.94
  Top 1.016: 70.7,59.94 Q3.4
N$21
  Top 0.305: 8.09,34.29 R8.1 LED1.K
N$22
  Top 0.305: R7.1 LED2.K
N$23
  Top 0.305: R6.1 LED3.K
N$24
  Top 0.305: 8.09,19.04 R5.1 LED4.K
N$25
  Top 0.305: IC2.41 18.58,37.13 15.2,40.51 11.39,40.76 10,42.16 S1.5
  Bottom 0.305: R9.1 11.27,40.89 10,42.16 S1.5
N$26
  Top 0.305: IC2.40 19.18,37.93 13.68,44.19 9.74,44.19 S1.6
  Bottom 0.305: R10.1 10.5,44.06 9.87,44.7 S1.6
N$27
  Top 0.305: IC2.39 19.77,38.73 11.9,47.37 9.36,47.37 S1.7
  Bottom 0.305: S1.7 R11.1
N$28
  Top 0.305: IC2.38 20.62,39.53 11.01,49.91 9.36,49.91 S1.8
  Bottom 0.305: S1.8 9.36,49.78 10,50.41 R12.1
N$29  (via drill 0.6 pad 1.2)
  Top 0.305: U$8.3 R2.1 65.36,36.82 v69.43,36.83 | 90.13,52.32 U$5.3 92.29,52.32 v93.43,53.46
  Bottom 0.305: v93.43,53.46 93.56,53.34 93.56,45.33 83.53,35.3 70.95,35.3 v69.43,36.83
N$30
  Top 0.305: R3.2 LED5.K
N$31
  Top 0.305: LED6.K R4.2
N$32  (via drill 0.6 pad 1.2)
  Top 0.305: R15.2 45.05,27.17 44.92,27.3 ICSP.1 | IC2.18 arc-45 34.12,39.49 32.47,39.49 32.47,34.77 arc45 32.55,34.59 33.24,33.9 35.8,33.9 arc-45 35.98,33.83 v36.79,33.02
  Bottom 0.305: v36.79,33.02 36.79,30.45 arc45 36.87,30.27 39.84,27.3 ICSP.1
N$35
  Top 1.016: 50.51,61.34 50.51,61.46 52.03,59.94 U$1.1
  Top 1.93: U$9.2 50.51,61.34 50.76,61.34 C15.+
  Bottom 0.305: U$9.2 38.95,61.34 34.89,57.27 34.89,46.98 37.94,43.94 37.94,35.43 37.55,35.05 19.65,35.05 17.61,33.02 17.61,29.2 13.93,25.52 13.93,12.7 13.17,11.93 1.99,11.93 0.85,10.79 0.85,5.33 LED7.A
  Bottom 1.93: C15.+ 54.57,64 57.24,61.34 65.62,61.34 69.69,65.4 SERVO+VE.P$1
N$36  (via drill 0.6 pad 1.2)
  Top 0.305: R13.1 U$13.3 56.98,30.22 59.91,27.3 v60.29,27.3 | U$1.3 50.13,57.4 49.11,56.38 v49.11,54.61
  Bottom 0.305: v49.11,54.61 49.11,50.29 53.17,46.22 53.17,31.49 55.59,29.08 58.51,29.08 v60.29,27.3
N$37
  Top 0.305: LED7.K R14.2
N$38  (via drill 0.6 pad 1.2)
  Top 0.305: U$13.1 55.9,31.54 arc45 55.72,31.62 55.72,34.79 54.19,36.32 54.19,39.13 arc45 54.12,39.31 52.29,41.14 46.68,41.14 arc-45 46.5,41.22 44.54,43.18 41.47,43.18 arc-45 41.29,43.25 v39.2,45.33 | v36.03,48.51 34.1,48.51 arc45 33.92,48.44 32.6,47.11 31.05,47.11 arc45 30.88,47.04 30.06,46.22 30.06,44.57 30.02,44.54 arc-45 IC2.26
  Bottom 0.305: v36.03,48.51 v39.2,45.33
N$39
  Top 0.25: U$14.3 47.63,64.94
  Top 0.305: 47.63,64.94 48.86,66.16 48.86,75.69 U$15.P$1
  Top 1.93: VBATT+VE.P$2 46.19,77.46 U$15.P$1
N$40
  Top 0.305: C20.1 20.54,41.14 21.42,40.25 22.57,40.25 22.61,40.3 IC2.37
N$42  (via drill 0.6 pad 1.2)
  Top 0.305: IC2.25 30.81,46.08 33.24,46.1 33.8,46.66 arc45 33.87,46.84 v33.87,46.86 | U$11.1 25.23,66.52 25.23,66.54 22.7,66.54 v21.27,64.82
  Bottom 0.305: v33.87,46.86 26.12,47.11 23.2,50.03 23.2,62.99 v21.27,64.82
N$43  (via drill 0.6 pad 1.2)
  Top 0.305: IC2.27 29.21,46.16 arc-45 29.28,46.34 30.95,48 32.5,48 arc45 32.67,48.08 34.43,49.83 arc-45 34.61,49.91 v37.43,49.91 | U$8.1 59.71,31.41 arc-45 59.53,31.48 59.27,31.74 59.27,37.97 arc90 59.02,38.22 55.21,38.22 55.21,39.39 arc45 55.13,39.57 52.54,42.16 47.18,42.16 arc-45 47,42.23 44.92,44.32 42.87,44.32 arc-45 42.69,44.39 v40.48,46.6
  Bottom 0.305: v40.48,46.6 40.48,46.75 arc45 40.4,46.93 v37.43,49.91
N$44
  Top 0.305: R7.2 13.04,29.2 14.06,30.22 24.85,30.22 26,31.36 26,32.89 26.01,32.9 IC2.3
N$46
  Top 0.305: 39.71,3.17 37.81,3.17 37.17,3.8 37.17,5.46 37.81,6.09 38.7,6.09 XB1.3 | XB1.3 38.82,6.22 | XB1.3
  Top 0.406: SLUG.4 51.65,29.84 54.06,27.43 54.06,20.06 52.54,18.54 45.05,18.54 43.27,16.5 42.63,15.87 42.63,5.96 39.84,3.17 39.71,3.17
N$47
  Top 0.305: IC2.16 40,37.93 40.48,37.46 ICSP.5
N$48
  Top 0.305: IC2.17 38.95,38.73 40.22,40 41.62,40.13 ICSP.6
N$49
  Top 0.406: 7.51,59.69 7.46,59.69 | USB1.VBUS 7.51,59.69 | 7.51,59.69 R16.2
N$50
  Top 0.305: R8.2 14.19,31.11 24.6,31.11 25.23,31.74 25.23,32.89 25.21,32.91 IC2.2
N$51
  Top 0.305: 3.9,59.94 3.9,60.32 4.53,60.96 6.31,60.96 7.53,62.17 USB1.D-
  Top 0.406: IC2.42 15.19,36.33 12.92,38.6 8.34,38.6 6.69,41.02 6.69,56.26 3.9,59.18 3.9,59.94
N$52
  Top 0.406: IC2.43 14.46,35.53 12.54,37.46 7.71,37.46 5.55,40.38 5.55,55.75 2.76,58.54 2.76,60.96 4.03,62.23 5.55,62.23 USB1.D+
N$53
  Top 0.305: IC2.5 27.61,30.82 23.71,26.92 19.52,26.92 14.06,21.46 14.06,20.57 12.54,19.04 R5.2
N$54
  Top 1.93: CHRG-CHARGE.P$2 15.84,76.19 14.57,74.92 J1.3
N$55
  Top 0.305: 19.71,34.73 17.3,34.73 JP1.1
  Top 0.406: 19.71,34.73 IC2.44
N$56
  Top 0.25: 40.64,65.44 U$14.7
  Top 0.305: 40.64,65.44 39.97,64.77 R19.2
N$57
  Top 0.305: R17.1 60.66,16.63 60.67,16.63 60.66,16.63 R18.2 60.66,20.18 arc-45 60.67,20.19 60.67,24.76 54.57,30.86 54.57,34.41 53.3,35.68 53.3,38.73 51.85,40.18 arc45 51.67,40.25 45.94,40.25 44.36,41.83 arc45 44.18,41.91 39.97,41.91 38.47,40.4 arc-45 38.29,40.33 IC2.19
N$58
  Top 0.25: U$14.6 41.33,65.94 40.48,66.54
  Top 0.305: 40.48,66.54 36.66,66.54 36.16,66.03 36.16,65.53 R19.1 36.15,62.36 36.16,62.35 R20.2
N$59  (via drill 0.6 pad 1.2)
  Top 0.305: IC2.1 23.99,32.51 v21.42,32.51
  Top 0.406: SLUG.5 52.79,27.3 53.17,26.79 53.17,21.08 52.16,20.06 44.79,20.06 41.62,16.89 41.62,7.11 38.7,4.19 38.71,4.17 XB1.2
  Bottom 0.305: v21.42,32.51 29.43,24.51 47.08,24.51 48.86,26.41 48.86,27.3 SLUG.5
N$60
  Top 0.3: 42.59,64.94 U$14.8
  Top 0.305: 42.59,64.94 43.02,64.51 43.02,51.56 36.54,45.08 36.54,42.41 35.27,41.14 34.25,41.14 34.24,41.13 IC2.20
N$61  (via drill 0.6 pad 1.2)
  Top 0.25: U$14.1 45.63,63.9 45.68,63.9
  Top 0.3: 46.44,63.24 46.44,63.62 46.19,63.88 45.68,63.88
  Top 0.305: IC2.11 34.67,32.93 v34.76,33.02 | v45.68,56.51 44.54,57.65 44.54,62.23 45.17,62.86 46.06,62.86 46.44,63.24 | 45.68,63.88 45.68,63.9
  Bottom 0.305: v34.76,33.02 35.27,33.9 37.17,33.9 38.57,35.3 38.57,40.15 arc-45 38.64,40.33 40.86,42.54 41.77,42.54 arc45 41.95,42.61 42.89,43.56 42.89,53.61 arc-45 42.96,53.79 v45.68,56.51
N$62
  Top 0.25: 41.67,51.99 U$14.10
  Top 0.305: 41.67,51.99 31.58,41.91 31.58,32.89 31.61,32.91 IC2.10
N$63  (via drill 0.6 pad 1.2)
  Top 0.305: IC2.12 35.84,34.73 v36.54,35.94 | R16.1 v18.5,59.69
  Bottom 0.305: v36.54,35.94 32.73,35.94 21.81,46.86 21.81,56.38 v18.5,59.69
N$67
  Top 0.305: 28.62,48.38 28.77,48.38 C19.1
  Top 0.406: IC2.30 26.77,44.57 26.76,44.57 26.76,48.38 | 26.76,48.38 Q4.2 | 26.76,48.38 28.62,48.38
N$68
  Top 0.305: C18.1 30.54,58.21 29.83,58.92 Q4.1
  Top 0.406: Q4.1 24.09,57.15 24.09,46.22 24.22,46.1 25.49,46.1 26,45.59 26,44.54 IC2.31
N$69
  Top 0.305: R6.2 15.21,24.12 19.02,27.81 23.33,27.81 26.89,31.36 26.89,32.76 26.76,32.89 IC2.4
SCL  (via drill 0.6 pad 1.2)
  Top 0.305: 43.27,36.19 40.09,36.19 | 54.95,29.08 53.43,30.6 53.43,33.65 52.16,34.92 SLUG.2 | 54.95,29.08 55.08,28.95 | 57.11,17.27 58.89,19.04 58.89,25.14 54.95,29.08
  Top 0.406: IC2.9 30.81,32.14 31.33,31.62 38.06,31.62 38.32,31.87 38.32,33.27 39.33,34.29 39.33,35.68 39.84,36.19 40.09,36.19 | 43.27,36.19 47.33,36.19 48.6,34.92 SLUG.2 | v45.68,15.87 47.08,17.27 57.11,17.27
  Bottom 0.305: CON1.4 45.68,11.93 v45.68,15.87
  Bottom 0.406: CON1.4 50.63,6.98 62.7,6.98 | 62.7,6.98 76.67,6.98 | 76.67,6.98 88.73,6.98 CON4.4 | 76.67,6.98 CON3.4 | 62.7,6.98 CON2.4
SDA  (via drill 0.6 pad 1.2)
  Top 0.305: 43.65,33.65 40.22,33.65 | SLUG.3 52.03,32.38 52.79,31.62 52.79,30.35 56.22,26.92 v56.22,22.86
  Top 0.406: CON4.2 93.18,8.25 91.91,6.98 79.21,6.98 | 65.24,6.98 53.17,6.98 CON1.2 | 65.24,6.98 79.21,6.98 | 65.24,6.98 CON2.2 | 79.21,6.98 CON3.2 | IC2.8 30.01,31.92 30.31,31.62 30.31,31.49 31.08,30.73 38.57,30.73 39.2,31.36 39.2,33.02 39.84,33.65 40.22,33.65 | 43.65,33.65 47.59,33.65 48.86,32.38 SLUG.3
  Bottom 0.305: 48.48,10.54 50.13,9.65
  Bottom 0.406: v56.22,22.86 56.22,19.68 53.81,17.27 50,17.27 47.97,15.24 47.97,11.04 48.48,10.54 | 50.13,9.65 50.51,9.65 CON1.2
VLOGICRAW  (via drill 0.6 pad 1.2)
  Top 0.25: 40.73,64.44 U$14.9
  Top 0.305: 40.73,64.44 40.73,59.18 v39.33,57.78 | R2.2 61.56,39.62 | R2.2 | R13.2 | R13.2 R2.2 | R13.2 56.98,44.06 | R17.2 65.49,16.5 67.27,18.28 C1.+ 67.27,20.31
  Top 0.61: C6.+ 95.59,62.48 97.88,60.19 97.88,58.03 96.23,56.38 95.34,56.38 95.34,51.94 94.45,51.05 U$5.2 90,51.05 | C13.+ 46.7,47.11 44.79,49.02 44.79,51.3 47.33,53.84 47.33,56.89 49.11,58.67 U$1.2
  Top 1.27: U$5.5 84.01,57.02 C9.+ | U$1.5 58.76,56.13 58.76,52.95 C16.+
  Top 1.422: U$2.5 78.7,29.2 C4.+
  Top 1.93: C6.+ 94.83,62.61 91.78,65.65 C7.+ 83.02,65.65 82.26,64.89 | 82.26,64.89 U$7.P$2 81.11,59.91 84.01,57.02 | C13.+ 48.48,47.11 51.52,44.06 C14.+ 56.98,44.06 59.78,44.06 U$10.P$2 61.68,49.53 C16.+ | C1.+ 68.67,20.19 71.72,17.14 C2.+ 80.1,17.14 U$4.P$2 81.88,22.6 C4.+ | LOGICPWR2.P$1 76.67,70.48 82.26,64.89
  Bottom 0.305: v39.33,57.78 46.57,57.78 47.33,57.02 47.33,55.37 44.03,52.07 44.03,48.64 45.3,47.37 46.95,47.37 C13.+
  Bottom 1.93: U$7.P$2 81.11,59.18 74.38,52.45 65.37,52.45 61.68,48.76 U$10.P$2 | C6.+ 97.12,62.61 98.69,61.03 arc-45 98.77,60.85 98.77,46.46 arc-45 98.69,46.28 86.83,34.41 86.83,23.98 arc-45 86.76,23.8 U$4.P$2
VRAW
  Top 0.305: U$12.SOURCE 32.22,69.2 32.22,69.21 32.86,68.57 R1.2
  Top 2.54: U$12.SOURCE 33.38,68.44 arc45 33.56,68.52 34.25,69.21 37.3,69.2 CHRG-RUN.P$2
VREG3.3
  Top 0.305: ICSP.3 41.62,32.38 | R15.1 43.14,32.38 ICSP.3 | 28.79,29.71 28.28,30.22 28.28,32.8 IC2.6 28.41,42.29 27.52,43.18 27.52,44.45 IC2.29 | IC2.29 27.65,44.57 | IC2.29 | ICSP.3 46.95,32.38 47.71,31.62 47.71,24.51 40.38,17.17 35.39,17.17 | S1.3 3.01,44.7 4.03,43.68 4.03,40.13 1.1,37.21 1.1,2.28 2.38,1.01 37.55,1.01 38.71,2.17 XB1.1
  Top 0.406: CON4.1 94.45,12.06 93.18,13.33 80.48,13.33 | 66.51,13.33 54.45,13.33 CON1.1 | 66.51,13.33 80.48,13.33 | 66.51,13.33 CON2.1 | 80.48,13.33 CON3.1 | 28.79,29.71 28.92,29.59
  Top 1.016: 38.82,2.15 38.19,1.52 37.3,1.52 35.39,3.42 35.39,17.17 C12.1 32.56,18.45 28.66,22.35 28.66,29.59 28.79,29.71 C11.1
  Top 1.27: U$2.1 72.1,33.02 70.7,34.41 | 38.82,2.15 38.81,2.17 XB1.1 38.79,2.15 38.82,2.15 | CON1.1 52.54,12.57 51.14,13.97 47.84,13.97 45.55,11.68 45.55,6.85 40.6,1.9 39.2,1.9 38.95,2.15 38.82,2.15
  Top 1.93: C3.+ 70.83,34.41 70.7,34.41 U$3.2
  Bottom 0.305: S1.2 1.1,46.86 | S1.2 S1.1 | S1.2 1.1,44.95 1.23,44.83 1.1,44.7 S1.3 S1.4 | S1.4 1.1,41.78 | S1.4 1.61,39.47 arc-45 1.54,39.29 1.1,38.86 1.1,15.24 LED5.A
  Bottom 1.93: U$3.2 66.51,32.25 69.05,29.71 69.05,25.14 69.81,24.38 69.81,18.16 72.99,14.98 92.93,14.98 94.45,13.46 CON4.1
VREGSLUG5
  Top 1.27: U$5.1 91.02,49.78 92.04,48.38
  Top 1.93: C8.+ 92.04,48.38 U$6.2
  Bottom 0.305: SLUG.7 50.25,21.58 37.05,21.58 26.63,11.17 3.52,11.17 2.38,10.03 LED6.A
  Bottom 1.422: C8.+ 88.23,43.3 86.32,41.4 74.38,41.4 71.59,38.6 65.75,38.6 63.21,36.06 63.21,26.66 61.68,25.14 55.08,25.14 54.19,24.25 54.19,23.11 53.3,22.22 SLUG.7

### Text on the board
Top: REV4